# EAGLE schematic AccTestBrd (EAGLE 6.5.0)
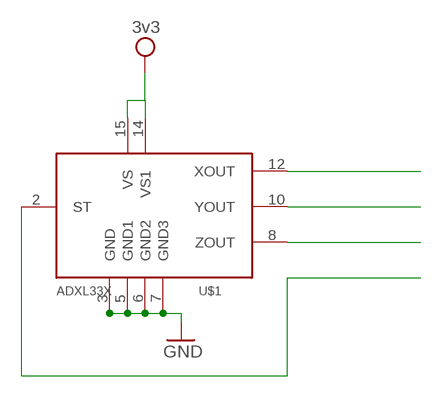
[diagram p0: schematic, sheet 1]

## Parts
U$1  ADXL33X  [16LCSP]

## Nets
GND: U$1.3(GND) U$1.5(GND1) U$1.6(GND2) U$1.7(GND3)
N$1: U$1.2(ST)
N$2: U$1.8(ZOUT)
N$3: U$1.10(YOUT)
N$4: U$1.12(XOUT)
VCC: U$1.14(VS1) U$1.15(VS) ; supply symbol labelled 3v3

## Library data of the parts
U$1 = adafruit:ADXL33X